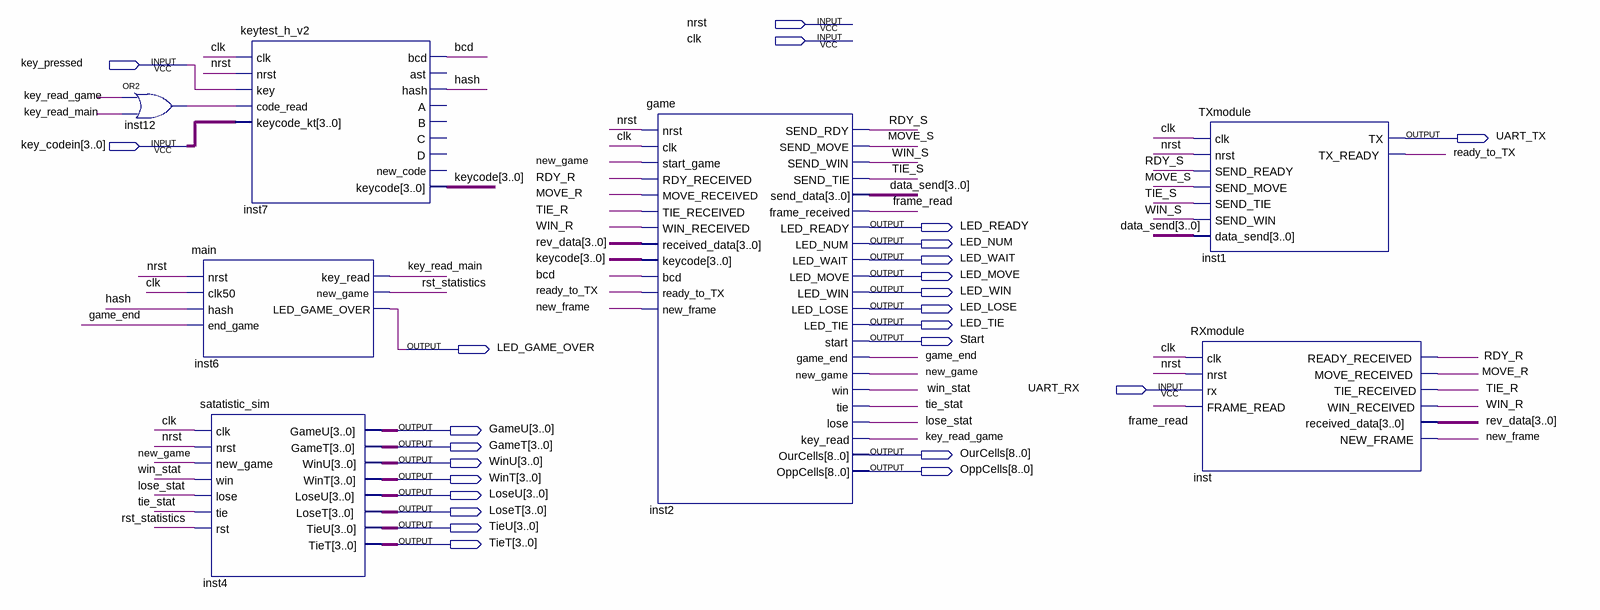
[diagram p0: schematic sheet]
// Quartus schematic player.bdf as structural Verilog: 7 symbols, 25 pins
module player (
  input  nrst,
  input  clk,
  input  key_pressed,
  input  [3:0] key_codein,
  input  UART_RX,
  output UART_TX,
  output LED_READY,
  output LED_NUM,
  output LED_WAIT,
  output LED_MOVE,
  output LED_WIN,
  output LED_LOSE,
  output LED_TIE,
  output Start,
  output LED_GAME_OVER,
  output [3:0] GameU,
  output [3:0] GameT,
  output [8:0] OurCells,
  output [3:0] WinU,
  output [8:0] OppCells,
  output [3:0] WinT,
  output [3:0] LoseU,
  output [3:0] LoseT,
  output [3:0] TieU,
  output [3:0] TieT
);

  wire bcd, frame_read, game_end, hash, inst12_out, key_read_game, key_read_main, lose_stat, MOVE_R, MOVE_S,
       new_frame, new_game, RDY_R, RDY_S, ready_to_TX, rst_statistics, TIE_R, TIE_S, tie_stat, WIN_R, WIN_S,
       win_stat;
  wire [3:0] data_send, keycode, rev_data;

  or inst12 (inst12_out, key_read_game, key_read_main);
  keytest_h_v2 inst7 (
    .clk(clk), .nrst(nrst), .key(key_pressed), .code_read(inst12_out), .keycode_kt(key_codein), .bcd(bcd),
    .hash(hash), .keycode(keycode));  // open: ast, A, B, C, D, new_code
  main inst6 (
    .nrst(nrst), .clk50(clk), .hash(hash), .end_game(game_end), .key_read(key_read_main),
    .new_game(rst_statistics), .LED_GAME_OVER(LED_GAME_OVER));
  satatistic_sim inst4 (
    .clk(clk), .nrst(nrst), .new_game(new_game), .win(win_stat), .lose(lose_stat), .tie(tie_stat),
    .rst(rst_statistics), .GameU(GameU), .GameT(GameT), .WinU(WinU), .WinT(WinT), .LoseU(LoseU),
    .LoseT(LoseT), .TieU(TieU), .TieT(TieT));
  game inst2 (
    .nrst(nrst), .clk(clk), .start_game(new_game), .RDY_RECEIVED(RDY_R), .MOVE_RECEIVED(MOVE_R),
    .TIE_RECEIVED(TIE_R), .WIN_RECEIVED(WIN_R), .received_data(rev_data), .keycode(keycode), .bcd(bcd),
    .ready_to_TX(ready_to_TX), .new_frame(new_frame), .SEND_RDY(RDY_S), .SEND_MOVE(MOVE_S), .SEND_WIN(WIN_S),
    .SEND_TIE(TIE_S), .send_data(data_send), .frame_received(frame_read), .LED_READY(LED_READY),
    .LED_NUM(LED_NUM), .LED_WAIT(LED_WAIT), .LED_MOVE(LED_MOVE), .LED_WIN(LED_WIN), .LED_LOSE(LED_LOSE),
    .LED_TIE(LED_TIE), .start(Start), .game_end(game_end), .new_game(new_game), .win(win_stat),
    .tie(tie_stat), .lose(lose_stat), .key_read(key_read_game), .OurCells(OurCells), .OppCells(OppCells));
  TXmodule inst1 (
    .clk(clk), .nrst(nrst), .SEND_READY(RDY_S), .SEND_MOVE(MOVE_S), .SEND_TIE(TIE_S), .SEND_WIN(WIN_S),
    .data_send(data_send), .TX(UART_TX), .TX_READY(ready_to_TX));
  RXmodule inst (
    .clk(clk), .nrst(nrst), .FRAME_READ(frame_read), .READY_RECEIVED(RDY_R), .MOVE_RECEIVED(MOVE_R),
    .TIE_RECEIVED(TIE_R), .WIN_RECEIVED(WIN_R), .received_data(rev_data), .NEW_FRAME(new_frame));  // open: rx
endmodule
